# Altium schematic sheet Sheet1.SchDoc
size A4
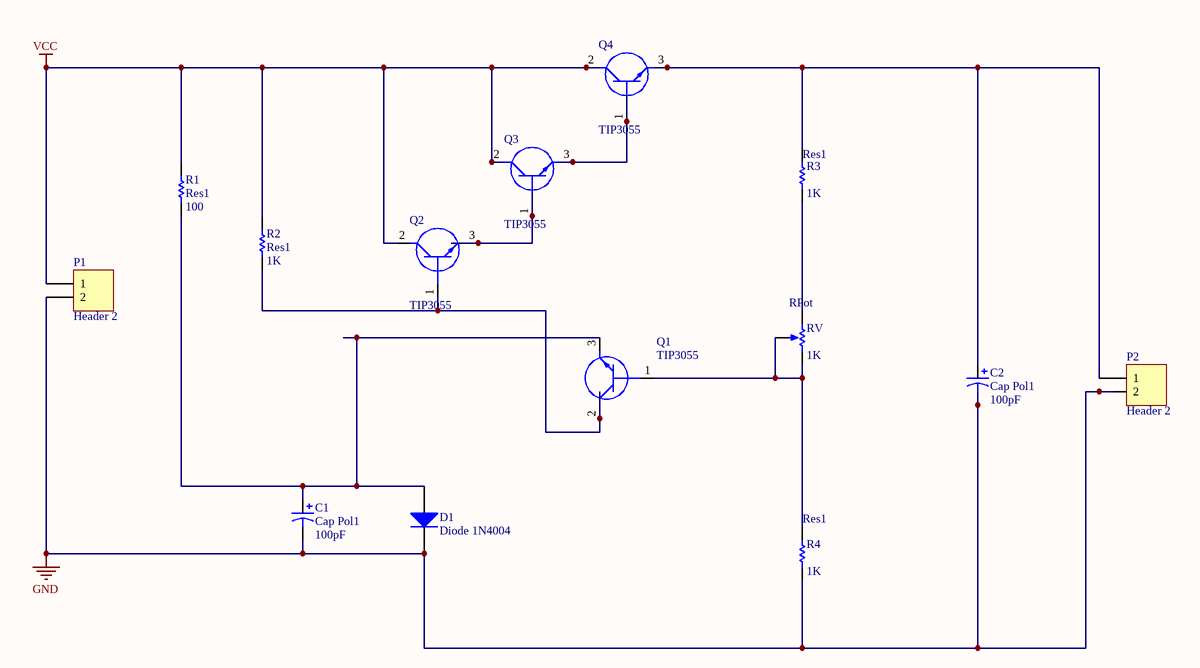
[diagram p0: Sheet1.SchDoc]

## Parts
C1  Cap Pol1  value 100pF  [RB7.6-15]
C2  Cap Pol1  value 100pF  [RB7.6-15]
D1  Diode 1N4004  [DO-41]
P1  Header 2  [HDR1X2]
P2  Header 2  [HDR1X2]
Q1  TIP3055  [TO545P515X1560X2445-3P]
Q2  TIP3055  [TO545P515X1560X2445-3P]
Q3  TIP3055  [TO545P515X1560X2445-3P]
Q4  TIP3055  [TO545P515X1560X2445-3P]
R1  Res1  value 100  [AXIAL-0.3]
R2  Res1  value 1K  [AXIAL-0.3]
R3  Res1  value 1K  [AXIAL-0.3]
R4  Res1  value 1K  [AXIAL-0.3]
RV  RPot  value 1K  [VR5]

## Nets
GND: C1.2 C2.2 D1.2(K) P1.2 P2.2 R4.1
VCC: P1.1 Q2.2(C) Q3.2(C) Q4.2(C) R1.2 R2.2
NetC1_1: C1.1 D1.1(A) Q1.3(E) R1.1
NetC2_1: C2.1 P2.1 Q4.3(E) R3.2
NetQ1_1: Q1.1(B) R4.2 RV.2(BOT) RV.3(TAP)
NetQ1_2: Q1.2(C) Q2.1(B) R2.1
NetQ2_3: Q2.3(E) Q3.1(B)
NetQ3_3: Q3.3(E) Q4.1(B)
NetR3_1: R3.1 RV.1(TOP)

## Library data of the parts
C1 C2 = Cap Pol1: Polarized Capacitor (Radial); Published: 8-Jun-2000; LatestRevisionDate: 17-Jul-2002; LatestRevisionNote: Re-released for DXP Platform.; PackageReference: RB7.6-15; Publisher: Altium Limited; PackageDescription: Polarized Capacitor (Radial); 2 Leads
D1 = Diode 1N4004: 1 Amp General Purpose Rectifier; Published: 8-Jun-2000; LatestRevisionDate: 17-Jul-2002; LatestRevisionNote: Re-released for DXP Platform.; DatasheetVersion: 1998; PackageVersion: Aug-1999; PackageReference: DO-41; Publisher: Altium Limited; PackageDescription: Diode, Axial; Body 5.2 x 2.7 mm (LxDia. max), Lead Dia. 0.86 mm (max); Code_JEDEC: DO-204-AL; ComponentLink1Description: Manufacturer Link; ComponentLink1URL: http://www.fairchildsemi.com/; ComponentLink2Description: Datasheet; ComponentLink2URL: http://www.fairchildsemi.com/ds/1N%2F1N4001.pdf
P1 P2 = Header 2: Header, 2-Pin; LatestRevisionDate: 17-Jul-2002; LatestRevisionNote: Re-released for DXP Platform.; Publisher: Altium Limited
Q1-Q4 = TIP3055: Transistor BJT NPN; Manufacturer_Name: STMicroelectronics; Allied_Number: 70014122; Datasheet Link: http://www.st.com/web/en/resource/technical/document/datasheet/CD00000918.pdf; Height: 5.15mm; Manufacturer_Part_Number: TIP3055; Mouser Part Number: 511-TIP3055; Mouser Price/Stock: https://www.mouser.com/Search/Refine.aspx?Keyword=511-TIP3055; RS Part Number: 1686168; RS Price/Stock: http://uk.rs-online.com/web/p/products/1686168; Allied Price/Stock: http://www.alliedelec.com/stmicroelectronics-tip3055/70014122/
R1-R4 = Res1: Resistor; Published: 8-Jun-2000; LatestRevisionDate: 17-Jul-2002; LatestRevisionNote: Re-released for DXP Platform.; PackageReference: AXIAL-0.3; Publisher: Altium Limited; PackageDescription: Axial Device, Thru-Hole; 2 Leads; 0.3 in Pin Spacing
RV = RPot: Potentiometer; Sim Note: Enter the Resistance value and the set point into parameter fields.; Set Position: 0.5; Published: 8-Jun-2000; LatestRevisionDate: 17-Jul-2002; LatestRevisionNote: Re-released for DXP Platform.; PackageReference: VR5; Publisher: Altium Limited; PackageDescription: Variable Resistor, Thru-Hole; 3 Leads